# Altium schematic sheet 3.3V Regulator.SchDoc
size A4; SheetNumber: 3; SheetTotal: 4
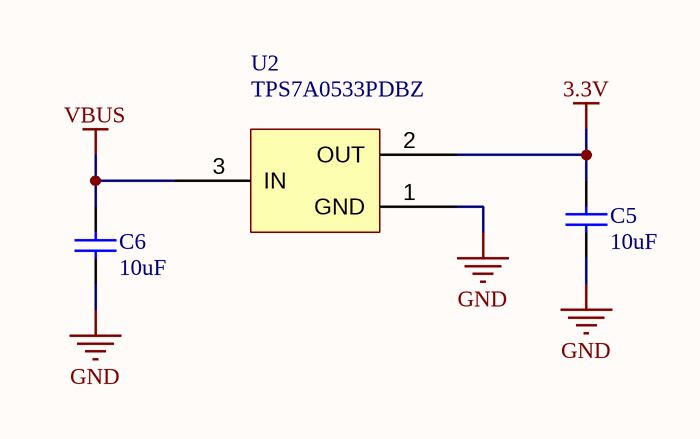
[diagram p0: 3.3V Regulator.SchDoc]

## Parts
C5  10uF  [Capacitor 0402]
C6  10uF  [Capacitor 0402]
U2  TPS7A0533PDBZ  [SOT-23]

## Nets
3.3V: C5.2 U2.2(OUT)
GND: C5.1 C6.1 U2.1(GND)
VBUS: C6.2 U2.3(IN)

## Notes on the sheet
- TITLE
- SIZE
- A4
- VARIANT
- PROJECT
- SHEET
- VERSION
- OF
- AUTHOR
- DATE

## Library data of the parts
C5 C6 = Capacitor